# EAGLE design tiny (EAGLE 9.5.2)
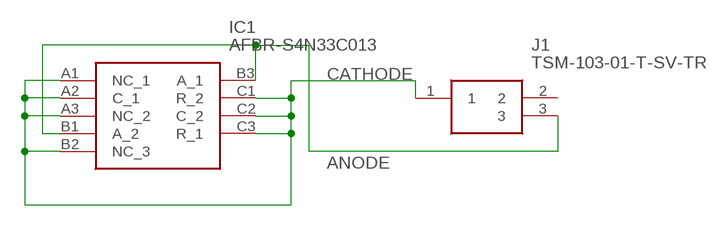
[diagram p0: schematic, sheet 1]

## Parts
IC1  AFBR-S4N33C013  [BGA9C100P3X3_314X314X59]
J1  TSM-103-01-T-SV-TR  [HUSRSP3W64P254_762X254X858P]

## Nets
ANODE: IC1.B1(A_2) IC1.B3(A_1) J1.3
CATHODE: IC1.A1(NC_1) IC1.A2(C_1) IC1.A3(NC_2) IC1.B2(NC_3) IC1.C1(R_2) IC1.C2(C_2) IC1.C3(R_1) J1.1
Unconnected: J1.2

## Library data of the parts
IC1 = AFBR-S4N33C013:AFBR-S4N33C013: AFBR-S4N33C013 NUV-HD Single Silicon Photo Multiplier Source: Datasheet <https://docs.broadcom.com/docs/AFBR-S4N33C013-DS>; DESCRIPTION: AFBR-S4N33C013 NUV-HD Single Silicon Photo Multiplier; HEIGHT: 0.59mm; MANUFACTURER_NAME: Avago Technologies; MANUFACTURER_PART_NUMBER: AFBR-S4N33C013; MOUSER_PART_NUMBER: 630-AFBR-S4N33C013; MOUSER_PRICE-STOCK: https://www.mouser.co.uk/ProductDetail/Broadcom-Avago/AFBR-S4N33C013?qs=vmHwEFxEFR8%2FmmB9oqY9Yg%3D%3D
J1 = TSM-103-01-T-SV-TR:TSM-103-01-T-SV-TR: Headers & Wire Housings .100" Surface Mount Terminal Strip Source: Datasheet <http://suddendocs.samtec.com/catalog_english/tsm.pdf>; ARROW_PART_NUMBER: TSM-103-01-T-SV-TR; ARROW_PRICE-STOCK: https://www.arrow.com/en/products/tsm-103-01-t-sv-tr/samtec; DESCRIPTION: Headers & Wire Housings .100" Surface Mount Terminal Strip; HEIGHT: mm; MANUFACTURER_NAME: SAMTEC; MANUFACTURER_PART_NUMBER: TSM-103-01-T-SV-TR; MOUSER_PART_NUMBER: 200-TSM10301TSVTR; MOUSER_PRICE-STOCK: https://www.mouser.co.uk/ProductDetail/Samtec/TSM-103-01-T-SV-TR/?qs=0lQeLiL1qybtyMm2dzXtjQ%3D%3D

## Board
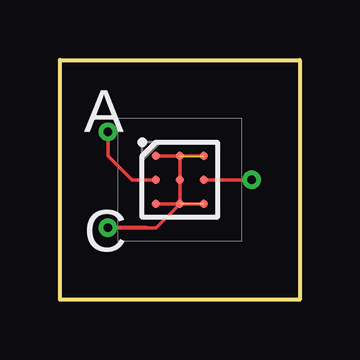
[diagram p1: board, top side]
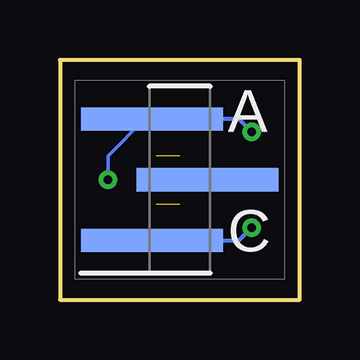
[diagram p2: board, bottom side, seen from below]

Size 10 x 10 mm. Coordinates in mm from the lower left corner, seen from the top.
Outline: 0,0 0,10 10,10 10,0 0,0
Copper layers (1*16): Top 0.035mm / dielectric 1.5mm / Bottom 0.035mm
Design rules "default": minimum track width 6mil, minimum drill 0.35mm, track to track 6mil, track to pad 6mil, pad to pad 6mil, via to via 6mil, smd to smd 6mil, copper to edge 40mil, drill to drill 6mil, minimum pad ring 10mil, minimum via ring 8mil, stop-mask expansion 4mil, vias tented up to drill 0mil, thermal gap 10mil

### Footprints (pad centres in the part's own frame; a part is rotated, then mirrored left to right if it is on the bottom)
BGA9C100P3X3_314X314X59 = smd 0.338 x 0.338: A1 -1,1; A2 0,1; A3 1,1; B1 -1,0; B2 0,0; B3 1,0; C1 -1,-1; C2 0,-1; C3 1,-1
HUSRSP3W64P254_762X254X858P = smd 0.96 x 5.92: 1 -2.54,1.16; 2 0,-1.16; 3 2.54,1.16

### Placement (x,y rotation side)
IC1  5,5 0 top
J1  5,5 90 bottom

### Tracks (layer width: path | path; a pad name or v marks a point on that pad's centre or on a via)
ANODE  (via drill 0.35)
  Top 0.152: IC1.B1 3,5 2,6 v2,7 | IC1.B3 v8,5
  Bottom 0.152: v8,5 8,6 6.46,7.54 6,7.54
  Bottom 0.16: v2,7 2.54,7.54 6,7.54 J1.3
CATHODE  (via drill 0.35)  (2 unrouted)
  Top 0.152: 3.6,3 4,3 IC1.C2 5,4.44 IC1.B2 5,5.56 IC1.A2 | IC1.A1 IC1.A3 | IC1.C1 IC1.C3
  Top 0.16: 3.6,3 v2,3
  Bottom 0.16: J1.1 2.54,2.46 v2,3

### Text on the board
tPlace: A | C
bPlace: A | C